# EAGLE design atxpd (EAGLE 7.2.0)
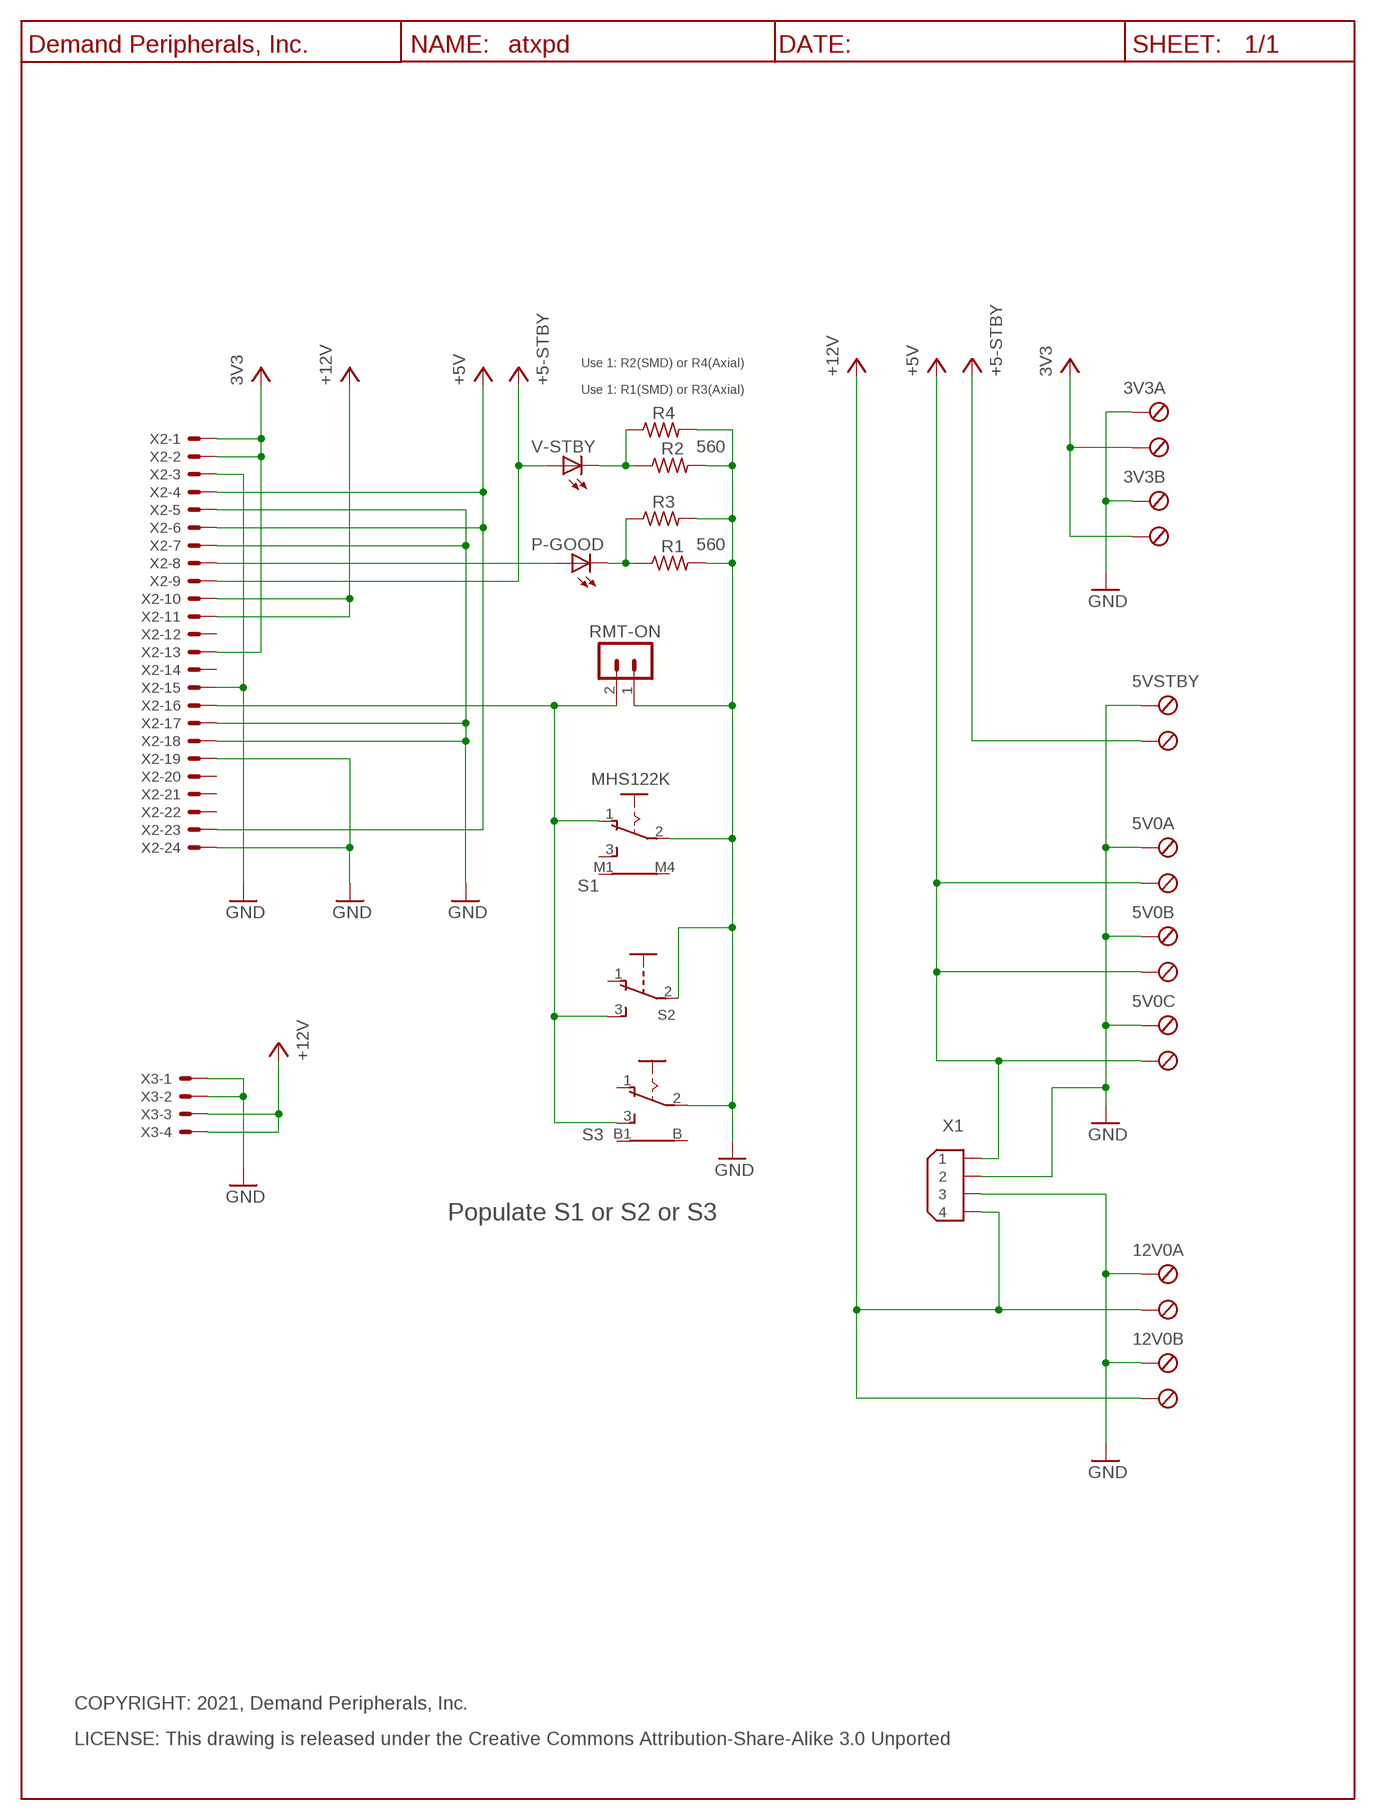
[diagram p0: schematic, sheet 1]

## Parts
3V3A  TBLK-5.08-X2  [TBLK-5.08-X2]
3V3B  TBLK-5.08-X2  [TBLK-5.08-X2]
5V0A  TBLK-5.08-X2  [TBLK-5.08-X2]
5V0B  TBLK-5.08-X2  [TBLK-5.08-X2]
5V0C  TBLK-5.08-X2  [TBLK-5.08-X2]
5VSTBY  TBLK-5.08-X2  [TBLK-5.08-X2]
12V0A  TBLK-5.08-X2  [TBLK-5.08-X2]
12V0B  TBLK-5.08-X2  [TBLK-5.08-X2]
P-GOOD  3mm_LED  LED-5MM-RED  [LED5MM]
R1  560  R560_R0603  [R0603]
R2  560  R560_R0603  [R0603]
R3  560  R560_  [R4TENTHS]
R4  560  R560_  [R4TENTHS]
RMT-ON  PinHdr254-2  HDR-2X1-LCK  [HDR-2X1]
S1  MHS122K  [MHS122K]
S2  TINYTOGGLE-SPDT-TH  [SPDT-TENTHINCH]
S3  Vert_SW(Option)  TOGGLE_SPDT_PC  [TOGGLE_SPDT_PC]
U$1  DP_FRAME_P  [LETTER_P]
V-STBY  3mm_LED  LED-5MM-GRN  [LED5MM]
X1  9090-4V  [9090-4V]
X2  ATX_Std  5566-24MOD  [5566-24MOD]
X3  ATX_Plus4  5566-4MOD  [5566-4MOD]

## Nets
+3,3V: 3V3A.2(KL1) 3V3B.2(KL1) X2.1 X2.2 X2.13 ; supply symbol labelled 3V3
+5V: 5V0A.2(KL1) 5V0B.2(KL1) 5V0C.2(KL1) X1.1 X2.4 X2.6 X2.23
+5V/1: 5VSTBY.2(KL1) V-STBY.A X2.9 ; supply symbol labelled +5-STBY
+5V/2: 12V0A.2(KL1) 12V0B.2(KL1) X1.4 X2.10 X2.11 X3.3 X3.4 ; supply symbol labelled +12V
GND: 3V3A.1(KL) 3V3B.1(KL) 5V0A.1(KL) 5V0B.1(KL) 5V0C.1(KL) 5VSTBY.1(KL) 12V0A.1(KL) 12V0B.1(KL) R1.2 R2.2 R3.2 R4.2 RMT-ON.1 S1.2(P) S2.2 S3.2(P) X1.2 X1.3 X2.3 X2.5 X2.7 X2.15 X2.17 X2.18 X2.19 X2.24 X3.1 X3.2
N$4: P-GOOD.A X2.8
N$5: P-GOOD.C R1.1 R3.1
N$6: R2.1 R4.1 V-STBY.C
N$7: RMT-ON.2 S1.1(O) S2.3 S3.3(S) X2.16
Unconnected: S1.3(S) S1.M1(B1) S1.M4(B) S2.1 S3.1(O) S3.B S3.B1 X2.12 X2.14 X2.20 X2.21 X2.22

## Notes on the sheet
- Use 1: R2(SMD) or R4(Axial)
- Use 1: R1(SMD) or R3(Axial)
- Populate S1 or S2 or S3
- COPYRIGHT: 2021, Demand Peripherals, Inc.
- LICENSE: This drawing is released under the Creative Commons Attribution-Share-Alike 3.0 Unported

## Library data of the parts
3V3A 3V3B 5V0A 5V0B 5V0C 5VSTBY 12V0A 12V0B = dpi-conn:TBLK-5.08-X2: Terminal Block, 5.08mm, x2, screw terminals; VENDOR: Digikey; VENDOR-PART-NUM: ED2609-ND
P-GOOD = dpi-diopto:LED-5MM-RED: Red LED, 5 MM, through-hole; VENDOR: Digikey; VENDOR-PART-NUM: 160-1853-ND
R1 R2 = dpi-passive:R560_: 560 Ohm resistor, 1%, 0.1 watt; VENDOR: Digikey; VENDOR-PART-NUM: 311-560HRTR-ND
R3 R4 = dpi-passive:R560_: 560 Ohm resistor, 1%, 0.1 watt; VENDOR: Digikey; VENDOR-PART-NUM: CF18JT560RCT-ND
RMT-ON = dpi-conn:HDR-2X1-LCK: 2x1 pin header with friction lock; VENDOR: Mouser; VENDOR-PART-NUM: 571-6404562
S1 = dpi-swsens:MHS122K: SPDT SLIDE SWITCH; VENDOR: Digikey; VENDOR-PART-NUM: 679-1866-ND
S2 = dpi-swsens:TINYTOGGLE-SPDT-TH: SPDT Toggle switch with 0.1 inch centers; VENDOR: Digikey; VENDOR-PART-NUM: EG2459-ND
S3 = dpi-swsens:TOGGLE_SPDT_PC: SPDT TOGGLE SWITCH; VENDOR: Digikey; VENDOR-PART-NUM: CKN1454-ND
U$1 = DP:DP_FRAME_P: Portrait/Letter Document Frame
V-STBY = dpi-diopto:LED-5MM-GRN: Green LED, 5 MM, through-hole; VENDOR: Digikey; VENDOR-PART-NUM: 160-1852-ND
X1 = dpi-conn:9090-4: Disk Drive Power, 4 position; VENDOR: Mouser; VENDOR-PART-NUM: 538-15-24-4449
X2 = dpi-conn:5566-24: Mini FIT connector 24 pol Source: http://www.molex.com; VENDOR: Digikey; VENDOR-PART-NUM: WM9738-ND
X3 = dpi-conn:5566-4: Molex Mini FIT connector 4 pol; VENDOR: Digikey; VENDOR-PART-NUM: A30669-ND

## Board
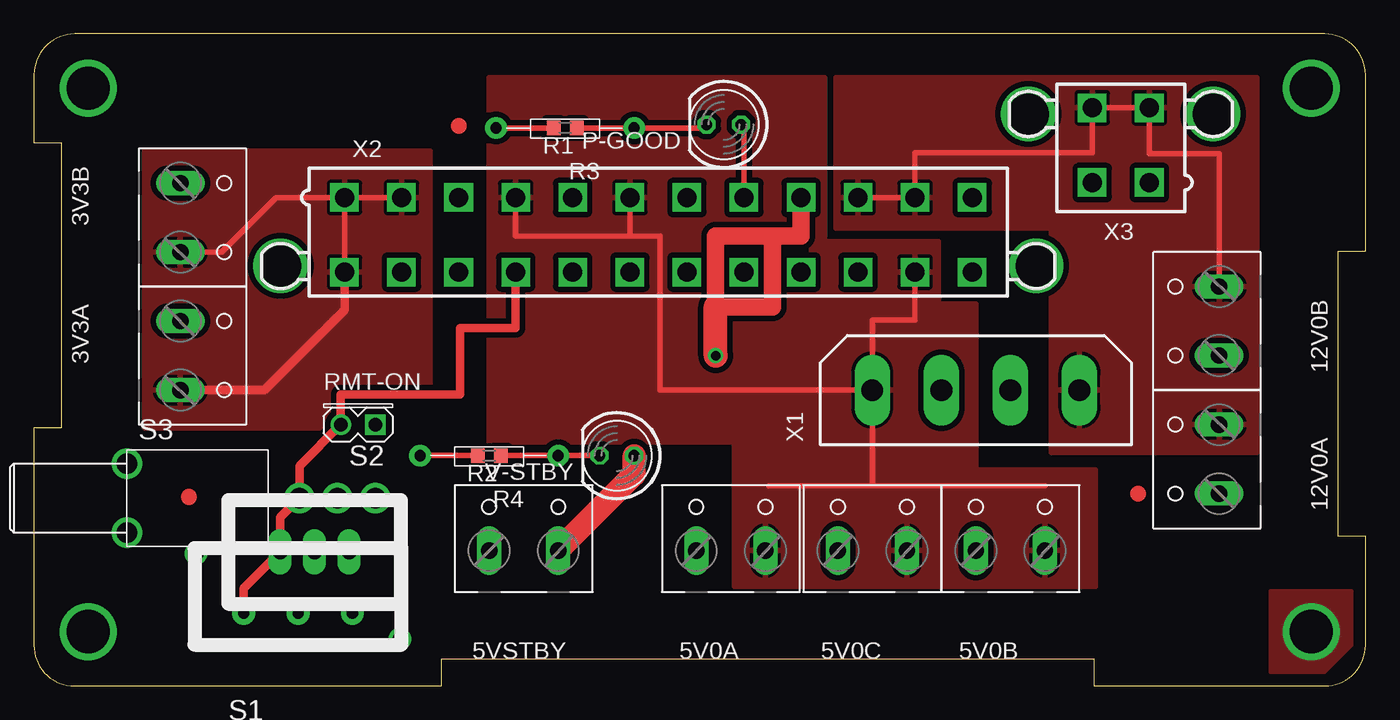
[diagram p1: board, top side]
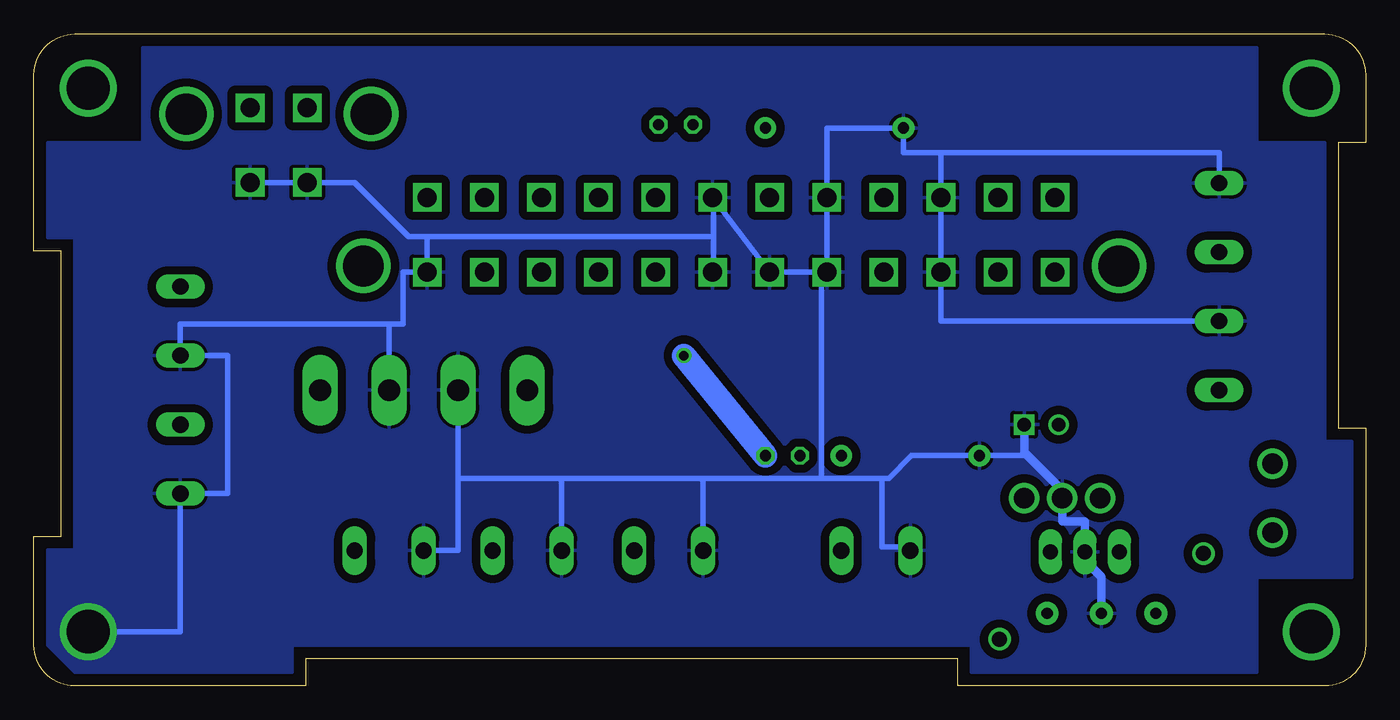
[diagram p2: board, bottom side, seen from below]

Size 98 x 48 mm. Coordinates in mm from the lower left corner, seen from the top.
Outline: 0,45 0,40 2,40 2,19 0,19 0,3 arc90 2.98,0 30,0 30,2 78.01,2 78.01,0 95,0 arc90 98,3 98,11 96,11 96,32 98,32 98,45 arc90 95,48 3,48 arc90 0,45
Copper layers (1*16): Top 0.035mm / dielectric 1.5mm / Bottom 0.035mm
Design rules "default *": minimum track width 10mil, minimum drill 24mil, track to track 8mil, track to pad 8mil, pad to pad 8mil, via to via 8mil, smd to smd 8mil, copper to edge 20mil, drill to drill 8mil, minimum pad ring 10mil, minimum via ring 8mil, stop-mask expansion 4mil, vias tented up to drill 0mil, thermal gap 10mil

### Footprints (pad centres in the part's own frame; a part is rotated, then mirrored left to right if it is on the bottom)
TBLK-5.08-X2 = drill 1.194 long: 1 -2.54,-0.127; 2 2.54,-0.127
LED5MM = drill 0.813 octagon: A -1.27,0; C 1.27,0
R0603 = smd 1 x 1.1: 1 -0.85,0; 2 0.85,0
R4TENTHS = drill 0.813 pad 1.6: 1 -5.08,0; 2 5.08,0
HDR-2X1 = drill 1.016 square: 1 1.27,0 | drill 1.016: 2 -1.27,0
MHS122K = drill 0.813 pad 1.676: 1 4,0; 2 0,0; 3 -4,0 | drill 1.1: M1 -7.5,1.9; M4 7.5,-4.4
SPDT-TENTHINCH = drill 1.1 pad 1.676 long: 1 2.54,0; 2 0,0; 3 -2.54,0
TOGGLE_SPDT_PC = drill 1.5 pad 1.676: 1 18.288,0; 2 15.494,0; 3 12.7,0 | drill 1.5 pad 1.778: B 0,-2.54; B1 0,2.54
9090-4V = drill 1.6 pad 2.6 long: 1 -7.62,0; 2 -2.54,0; 3 2.54,0; 4 7.62,0
5566-24MOD = drill 1.4 square: 1 23.1,-2.75; 2 18.9,-2.75; 3 14.7,-2.75; 4 10.5,-2.75; 5 6.3,-2.75; 6 2.1,-2.75; 7 -2.1,-2.75; 8 -6.3,-2.75; 9 -10.5,-2.75; 10 -14.7,-2.75; 11 -18.9,-2.75; 12 -23.1,-2.75; 13 23.1,2.75; 14 18.9,2.75; 15 14.7,2.75; 16 10.5,2.75; 17 6.3,2.75; 18 2.1,2.75; 19 -2.1,2.75; 20 -6.3,2.75; 21 -10.5,2.75; 22 -14.7,2.75; 23 -18.9,2.75; 24 -23.1,2.75 | drill 3 pad 3.508: P$1 -27.8,2.29; P$2 27.8,2.29
5566-4MOD = drill 1.4 square: 1 2.1,-2.75; 2 -2.1,-2.75; 3 2.1,2.75; 4 -2.1,2.75 | drill 3 pad 3.508: P$1 -6.8,2.29; P$2 6.8,2.29

### Placement (x,y rotation side)
3V3A  10.9,24.32 270 top
3V3B  10.9,34.48 270 top
5V0A  51.29,10.09 0 top
5V0B  71.86,10.09 0 top
5V0C  61.7,10.09 0 top
5VSTBY  36.05,10.09 0 top
12V0A  87.1,16.7 90 top
12V0B  87.1,26.86 90 top
P-GOOD  50.78,41.34 180 top
R1  39.09,41.08 180 top
R2  33.51,16.95 180 top
R3  39.09,41.08 180 top
R4  33.51,16.95 180 top
RMT-ON  23.85,19.24 0 top
S1  19.43,5.34 180 top
S2  20.65,9.86 0 top
S3  6.84,13.83 0 top
U$1  -0.57,-0.58 0 top
U$9  [FIDUCIAL]  31.27,41.23 0 top
U$10  [FIDUCIAL]  11.41,13.9 0 top
U$11  [FIDUCIAL]  81.26,14.16 0 top
U$12  [DPI-2]  20.3,42.7 0 top
U$13  [DPI-2]  20.3,42.7 0 bottom
V-STBY  42.9,16.95 180 top
X1  69.32,21.78 0 top
X2  45.95,33.21 180 top
X3  79.99,39.81 0 top

### Tracks (layer width: path | path; a pad name or v marks a point on that pad's centre or on a via)
+3,3V
  Top 0.406: X2.1 X2.2 | X2.13 X2.1 | X2.1 17.84,35.96 13.82,31.94 3V3B.2
  Top 0.61: 3V3A.2 16.96,21.78 22.85,27.66 X2.13
  pour Top (isolate 0.406): 8.16,39.35 29.16,39.35 29.16,18.98 8.16,18.98
+5V
  Top 0.406: X2.4 35.45,33.11 43.87,33.11 | 43.87,33.11 X2.6 | 43.87,33.11 46.08,33.11 46.08,21.78 X1.1 | 61.78,14.73 61.74,14.73 | 61.78,14.73 64.29,14.73 | 64.29,14.73 72.08,14.73 74.4,14.73 | 54.08,14.73 61.78,14.73 | 64.29,14.73 64.24,14.73 | X2.23 64.85,26.95 64.11,26.95 61.7,26.95 X1.1 | 61.78,14.73 61.7,14.73 X1.1
  pour Top (isolate 0.406): 78.13,15.91 69.32,15.91 69.32,28.13 66.55,28.13 66.55,32.7 58.17,32.7 58.17,44.76 33.51,44.76 33.51,17.97 51.54,17.97 51.54,7.32 78.13,7.32
+5V/1  (via drill 0.7)
  Top 1.27: 54.36,33.13 50.17,33.13 50.17,27.9 54.36,27.9 54.36,33.13 | 54.36,33.13 56.45,33.13 X2.9
  Top 1.676: V-STBY.A 44.17,15.81 44.17,15.55 5VSTBY.2
  Top 1.778: v50.17,24.32 50.17,27.9
  Bottom 1.778: V-STBY.A v50.17,24.32
+5V/2
  Top 0.406: 12V0B.2 87.23,37.42 87.23,39.19 86.21,39.19 82.09,39.19 X3.3 X3.4 77.89,39.25 74.58,39.25 68.15,39.25 64.85,39.25 X2.11 X2.10
  pour Top (isolate 0.406): 90,17.21 74.88,17.21 74.88,33.72 59.03,33.72 59.03,44.76 90,44.76
GND  (via drill 3.17 pad 3.17)
  Top 0.406: R3.2 R1.2 | R4.2 R2.2
  Bottom 0.406: 40.05,30.46 X2.18 47.98,35.87 | 47.98,35.87 X2.7 | X3.1 X3.2 74.42,37.06 70.44,33.08 69.05,33.08 | 47.98,33.08 69.05,33.08 | 3V3A.1 31.25,26.86 X2.15 X2.3 31.25,39.25 | 3V3B.1 10.77,39.25 31.25,39.25 | 35.59,15.29 35.08,15.29 33.42,16.95 R4.2 25.36,16.95 arc-90 25.12,17.19 | 35.59,15.29 40.05,15.28 | 40.05,15.28 40.05,30.46 | 35.59,15.29 35.59,10.22 33.51,10.22 5VSTBY.1 | 71.86,26.63 70.84,26.63 70.84,30.46 X2.24 69.05,33.08 | 71.86,26.63 X1.3 | 71.86,26.63 87.23,26.63 12V0B.1 83.75,24.32 83.75,14.16 12V0A.1 87.23,4 v94,4 | 47.98,35.87 47.98,33.08 | X2.19 47.98,30.46 47.98,33.08 | 31.25,39.25 34.01,39.25 R3.2 39.65,41.08 X2.5 X2.17 40.05,30.46 | 5V0B.1 66.78,9.97 66.78,15.28 | 66.78,15.28 X1.2 | 40.05,15.28 48.91,15.28 | 48.91,15.28 59.33,15.28 | 59.33,15.28 66.78,15.28 | 5V0A.1 48.75,15.11 48.91,15.28 | 5V0C.1 59.16,15.11 59.33,15.28
  Bottom 0.61: S1.2 19.43,8.04 20.65,9.26 S2.2 20.65,12.13 22.33,12.13 S3.2 22.33,14.4 25.12,17.19 RMT-ON.1
  pour Bottom (isolate 0.61): 97,40 97,33 95,33 95,10 97,10 97,3 95,1 79,1 79,3 29,3 29,1 8,1 8,8 1,8 1,18 3,18 3,40 8,40 8,47 90,47 90,40
  pour Top: 91,7 97,7 97,3 95,1 91,1
MOUNT0  (via drill 3.17 pad 3.17)
  other vias: 4,4
MOUNT1  (via drill 3.17 pad 3.17)
  other vias: 4,44
MOUNT7  (via drill 3.17 pad 3.17)
  other vias: 94,44
N$4
  Top 0.406: P-GOOD.A 52.25,40.88 X2.8
N$5
  Top 0.406: R3.1 R1.1 49.51,41.08 P-GOOD.C
N$6
  Top 0.406: R2.1 R4.1 V-STBY.C
N$7
  Top 0.61: X2.16 35.45,26.35 31.35,26.35 31.35,21.46 22.58,21.46 RMT-ON.2 19.54,16.19 S3.3 18.11,12.4 S2.3 15.43,7.19 S1.1

### Text on the board
tTest: (C) 2021, Demand Peripherals, Inc. | ATXPD, Rev 21A | R1 | Power Good | R3 | 13 | 3.3V | 12V | 3.3V | RMT-ON | R2 | 12V | Standby | S3 | R4 | S2 | S1 | 5-STBY | 5V | 5V | 5V | On / Off